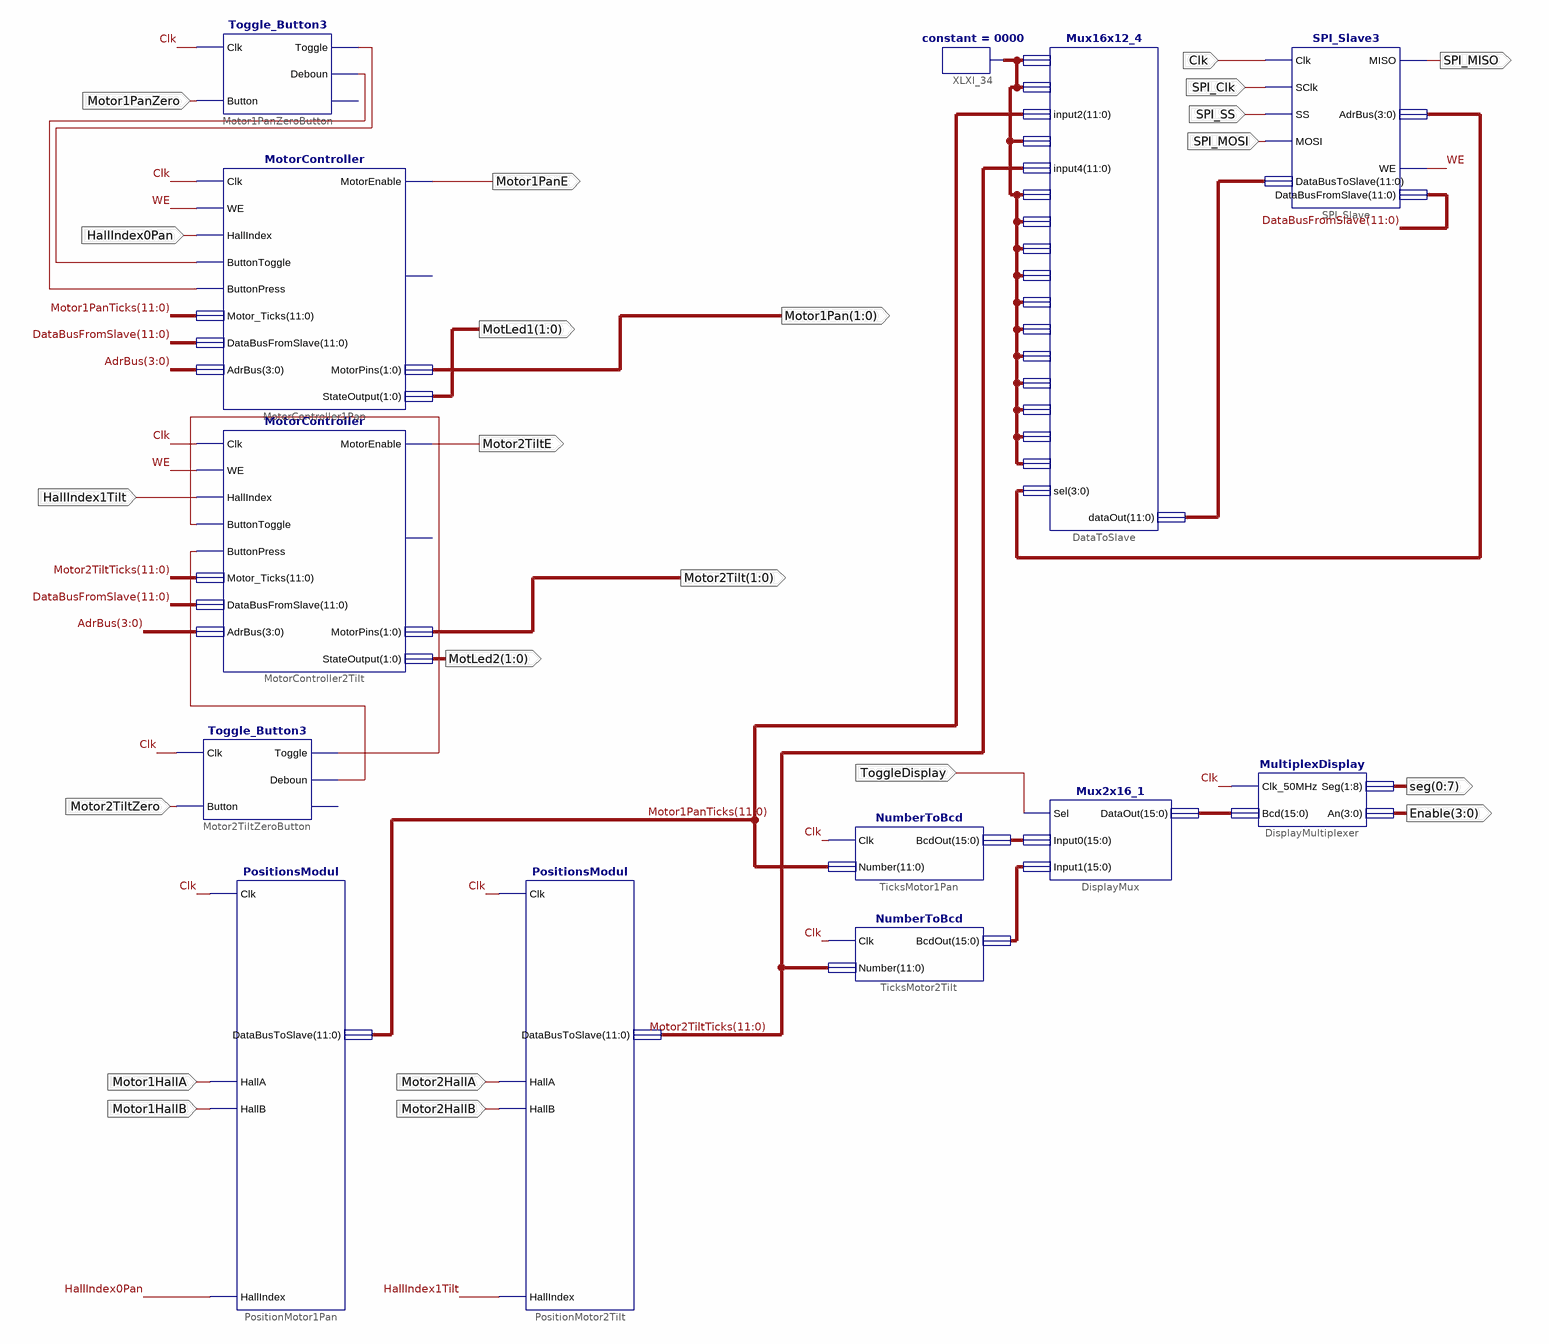
[diagram p0: schematic sheet 1]
// Xilinx ISE schematic Design.sch (spartan3e) as structural Verilog: 13 symbols, 22 ports
module Design (
  input  SPI_MOSI,
  input  SPI_SS,
  input  SPI_Clk,
  input  Clk,
  input  ToggleDisplay,
  input  Motor2HallA,
  input  Motor2HallB,
  input  Motor1HallA,
  input  Motor1HallB,
  input  HallIndex1Tilt,
  input  HallIndex0Pan,
  input  Motor1PanZero,
  input  Motor2TiltZero,
  output SPI_MISO,
  output [3:0] Enable,
  output [0:7] seg,
  output Motor2TiltE,
  output Motor1PanE,
  output [1:0] Motor1Pan,
  output [1:0] Motor2Tilt,
  output [1:0] MotLed1,
  output [1:0] MotLed2
);

  wire WE, XLXN_396, XLXN_397, XLXN_420, XLXN_421;
  wire [3:0] AdrBus;
  wire [11:0] DataBusFromSlave, Motor1PanTicks, Motor2TiltTicks, XLXN_123, XLXN_142;
  wire [15:0] XLXN_157, XLXN_158, XLXN_170;

  SPI_Slave3 SPI_Slave (
    .Clk(Clk), .SClk(SPI_Clk), .SS(SPI_SS), .MOSI(SPI_MOSI), .MISO(SPI_MISO), .WE(WE), .AdrBus(AdrBus),
    .DataBusFromSlave(DataBusFromSlave), .DataBusToSlave(XLXN_123));
  constant #(.CValue("0000")) XLXI_34 (.O(XLXN_142));
  Mux16x12_4 DataToSlave (
    .input0(XLXN_142), .input1(XLXN_142), .input2(Motor1PanTicks), .input3(XLXN_142),
    .input4(Motor2TiltTicks), .input5(XLXN_142), .input6(XLXN_142), .input7(XLXN_142), .input8(XLXN_142),
    .input9(XLXN_142), .input10(XLXN_142), .input11(XLXN_142), .input12(XLXN_142), .input13(XLXN_142),
    .input14(XLXN_142), .input15(XLXN_142), .sel(AdrBus), .dataOut(XLXN_123));
  MultiplexDisplay DisplayMultiplexer (.Clk_50MHz(Clk), .Bcd(XLXN_170), .Seg(seg), .An(Enable));
  Mux2x16_1 DisplayMux (.Sel(ToggleDisplay), .Input0(XLXN_157), .Input1(XLXN_158), .DataOut(XLXN_170));
  NumberToBcd TicksMotor2Tilt (.Clk(Clk), .Number(Motor2TiltTicks), .BcdOut(XLXN_158));
  NumberToBcd TicksMotor1Pan (.Clk(Clk), .Number(Motor1PanTicks), .BcdOut(XLXN_157));
  PositionsModul #(.Address(4)) PositionMotor2Tilt (
    .Clk(Clk), .HallA(Motor2HallA), .HallB(Motor2HallB), .DataBusToSlave(Motor2TiltTicks),
    .HallIndex(HallIndex1Tilt));
  PositionsModul #(.Address(2)) PositionMotor1Pan (
    .Clk(Clk), .HallA(Motor1HallA), .HallB(Motor1HallB), .DataBusToSlave(Motor1PanTicks),
    .HallIndex(HallIndex0Pan));
  MotorController #(.Boundary_Min(2000), .Boundary_Max(2650), .Address(3)) MotorController2Tilt (
    .Clk(Clk), .WE(WE), .HallIndex(HallIndex1Tilt), .ButtonPress(XLXN_397), .ButtonToggle(XLXN_396),
    .Motor_Ticks(Motor2TiltTicks), .DataBusFromSlave(DataBusFromSlave), .AdrBus(AdrBus),
    .MotorEnable(Motor2TiltE), .MotorPins(Motor2Tilt), .StateOutput(MotLed2));  // open: Zeroed
  MotorController #(.Address(1), .Boundary_Min(2000), .Boundary_Max(2100)) MotorController1Pan (
    .Clk(Clk), .WE(WE), .HallIndex(HallIndex0Pan), .ButtonPress(XLXN_420), .ButtonToggle(XLXN_421),
    .Motor_Ticks(Motor1PanTicks), .DataBusFromSlave(DataBusFromSlave), .AdrBus(AdrBus),
    .MotorEnable(Motor1PanE), .MotorPins(Motor1Pan), .StateOutput(MotLed1));  // open: Zeroed
  Toggle_Button3 Motor1PanZeroButton (
    .Clk(Clk), .Button(Motor1PanZero), .Toggle(XLXN_421), .Deboun(XLXN_420));  // open: Pulse
  Toggle_Button3 Motor2TiltZeroButton (
    .Clk(Clk), .Button(Motor2TiltZero), .Toggle(XLXN_396), .Deboun(XLXN_397));  // open: Pulse
endmodule
